# Altium project Harness_robottino.PrjPCB
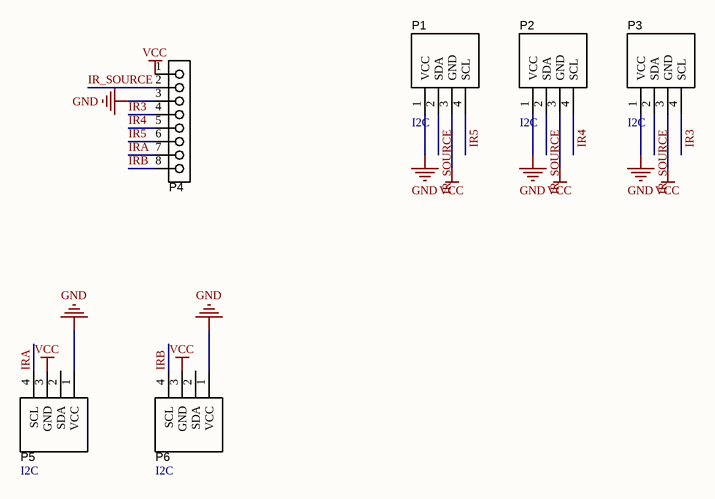
[diagram p0: Harness_robottino_schem.SchDoc]
1 sheet, 6 parts. Net scope: global (net labels, ports and power ports of the same name join across sheets).
Board files: Harness_robottino.PcbDoc, Panel_robottino.PcbDoc

## Sheet Harness_robottino_schem.SchDoc
size A4

### Parts
P1  I2C  [TYCO/215079-4]
P2  I2C  [TYCO/215079-4]
P3  I2C  [TYCO/215079-4]
P4  Header 8  [TYCO/215079-8]  (value not drawn)
P5  I2C  [TYCO/215079-4]
P6  I2C  [TYCO/215079-4]

### Nets
GND: P1.1(VCC) P2.1(VCC) P3.1(VCC) P4.3 P5.1(VCC) P6.1(VCC)
VCC: P1.3(GND) P2.3(GND) P3.3(GND) P4.1 P5.3(GND) P6.3(GND)
IR3: P3.4(SCL) P4.4
IR4: P2.4(SCL) P4.5
IR5: P1.4(SCL) P4.6
IR_SOURCE: P1.2(SDA) P2.2(SDA) P3.2(SDA) P4.2
IRA: P4.7 P5.4(SCL)
IRB: P4.8 P6.4(SCL)

Not connected (* = marked no-connect by the designer): P5 2(SDA); P6 2(SDA)

### Library data of the parts
P1-P3 P5 P6 = Micromatch-I2C: Micromatch I2C Connector
P4 = Header 8: Header, 8-Pin; LatestRevisionDate: 17-Jul-2002; LatestRevisionNote: Re-released for DXP Platform.; Publisher: Altium Limited